# EAGLE schematic vanity_lights-v1 (EAGLE 7.5.0)
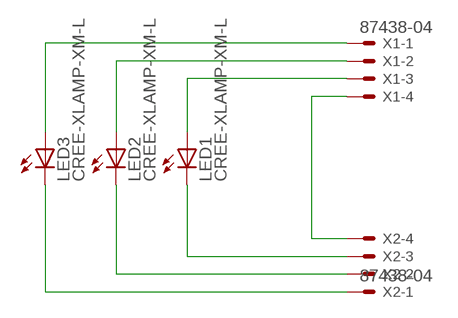
[diagram p0: schematic, sheet 1]

## Parts
LED1  CREE-XLAMP-XM-L  [CREE-XLAMP-XM-L]
LED2  CREE-XLAMP-XM-L  [CREE-XLAMP-XM-L]
LED3  CREE-XLAMP-XM-L  [CREE-XLAMP-XM-L]
X1  87438-04  [87438-04]
X2  87438-04  [87438-04]

## Nets
N$1: LED3.A LED3.A@1(A) X1.1
N$2: LED2.A LED2.A@1(A) X1.2
N$3: LED1.A LED1.A@1(A) X1.3
N$4: LED3.C LED3.C@1(C) X2.1
N$5: LED2.C LED2.C@1(C) X2.2
N$6: LED1.C LED1.C@1(C) X2.3
N$7: X1.4 X2.4

## Library data of the parts
LED1-LED3 = led:CREE-XLAMP-XM-L: Cree® XLamp® XM-L LEDs Source: http://www.cree.com
X1 X2 = con-molex:87438-04: Wire-to-Board 1.50mm (.059") Pitch Header - Right Angle, SMT, Shrouded Source: http://www.molex.com/product/micro/87438.html; OC_FARNELL: unknown; OC_NEWARK: unknown